# Altium schematic sheet Power Distribution - BMS,Rear Camera, and Charger.SchDoc: Title
size B; Organization: Midnight Sun Solar Rayce Car Team; Address1: University of Waterloo; Address2: 200 University Ave W; Address3: Waterloo, ON, Canada; Address4: N2L 3E9; Website: www.uwmidsun.com; ProjectName: ProjectName
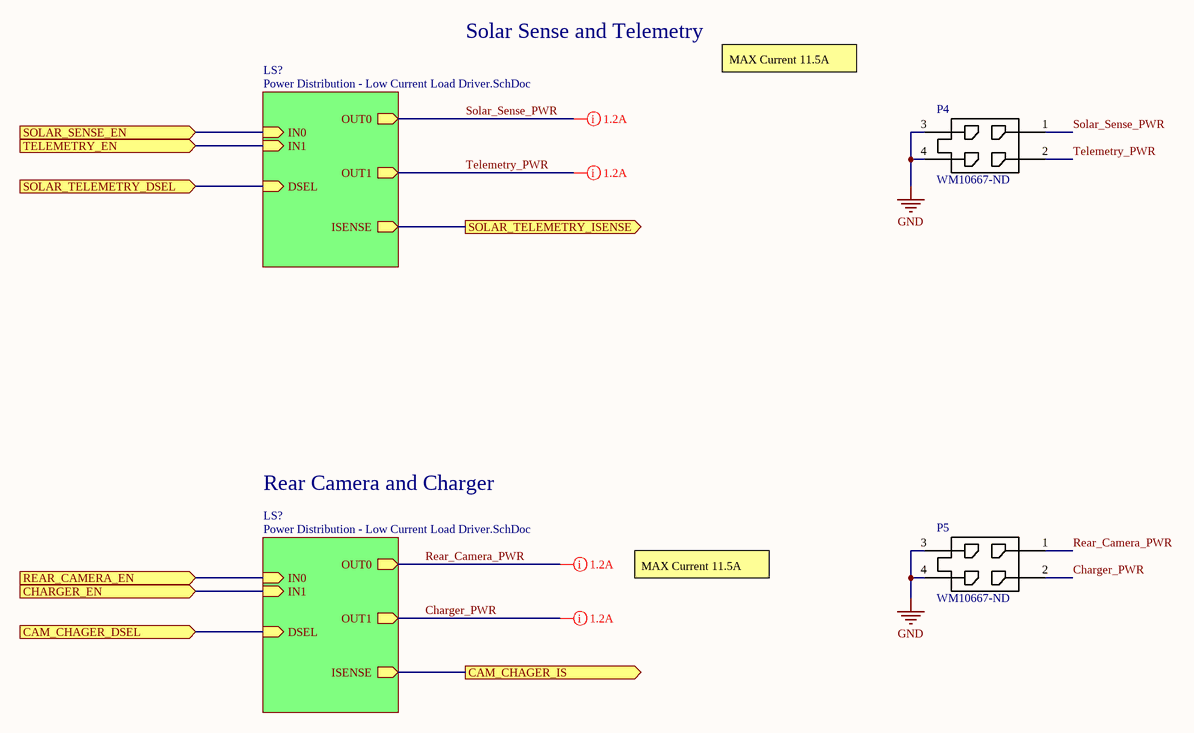
[diagram p0: Power Distribution - BMS,Rear Camera, and Charger.SchDoc]

## Parts
P4  Supplier Part Number 1: WM10667-ND  [CONN 4POS MICROFIT (2x2)]  (hidden comment: CONN 4POS MICRO-FIT 3mm)
P5  Supplier Part Number 1: WM10667-ND  [CONN 4POS MICROFIT (2x2)]  (hidden comment: CONN 4POS MICRO-FIT 3mm)

## Sub-sheets
LS? = Power Distribution - Low Current Load Driver.SchDoc: IN0 (in), IN1 (in), DSEL (in), ISENSE (out), OUT0 (out), OUT1 (out)
LS? = Power Distribution - Low Current Load Driver.SchDoc: IN0 (in), IN1 (in), DSEL (in), ISENSE (out), OUT0 (out), OUT1 (out)

## Ports
CAM_CHAGER_DSEL (in), CAM_CHAGER_IS (out), CHARGER_EN (in), REAR_CAMERA_EN (in), SOLAR_SENSE_EN (in), SOLAR_TELEMETRY_DSEL (in), SOLAR_TELEMETRY_ISENSE (out), TELEMETRY_EN (in)

## Nets
GND: P4.3 P4.4 P5.3 P5.4
CAM_CHAGER_DSEL: port CAM_CHAGER_DSEL, sheet LS?/DSEL
CAM_CHAGER_IS: port CAM_CHAGER_IS, sheet LS?/ISENSE
CHARGER_EN: port CHARGER_EN, sheet LS?/IN1
Charger_PWR: P5.2 ; sheet LS?/OUT1
REAR_CAMERA_EN: port REAR_CAMERA_EN, sheet LS?/IN0
Rear_Camera_PWR: P5.1 ; sheet LS?/OUT0
SOLAR_SENSE_EN: port SOLAR_SENSE_EN, sheet LS?/IN0
Solar_Sense_PWR: P4.1 ; sheet LS?/OUT0
SOLAR_TELEMETRY_DSEL: port SOLAR_TELEMETRY_DSEL, sheet LS?/DSEL
SOLAR_TELEMETRY_ISENSE: port SOLAR_TELEMETRY_ISENSE, sheet LS?/ISENSE
TELEMETRY_EN: port TELEMETRY_EN, sheet LS?/IN1
Telemetry_PWR: P4.2 ; sheet LS?/OUT1

## Layout directives
mark named 1.2A: Charger_PWR, Rear_Camera_PWR, Solar_Sense_PWR, Telemetry_PWR

## Notes on the sheet
- Solar Sense and Telemetry
- MAX Current 11.5A
- Rear Camera and Charger
- PROJECT
- DOCUMENT
- DRAWN BY
- LAST MODIFIED
- PART NUMBER
- REVISION
- SHEET
- VARIANT
- OF
- Engineering 5 - 1002
  University of Waterloo
  (519) 888-4567 x32978
  hardware@uwmidsun.com

## Library data of the parts
P4 P5 = CONN 4POS MICRO-FIT 3mm: Micro-Fit 3.0 Vertical Header, 3.00mm Pitch, Dual Row, 4 Circuits, with PCB Polarizing Peg, Tin, Glow-Wire Capable, Black; Manufacturer: Molex, LLC; Manufacturer Part Number: 430450427; Pitch - Mating: 0.118" (3.00mm); Number of Positions: 6; Number of Positions Loaded: All; Style: Board to Cable/Wire; Shrouding: Shrouded - 4 Wall; Contact Length - Post: 0.125" (3.18mm); Material Flammability Rating: UL94 V-0; Contact Resistance: 10mR; Number of Contacts: 4; Number of Ports: 1; Row Spacing: 0.118inch; RoHS: RoHS Compliant; Category: Connectors, Interconnects; Packaging: Tray; Part Status: Active; Connector Type: Header; Contact Type: Male Pin; Number of Rows: 2; Row Spacing - Mating: 0.118" (3.00mm); Mounting Type: Through Hole; Termination: Solder; Fastening Type: Locking Ramp; Contact Length - Mating: -; Overall Contact Length: -; Insulation Height: 0.390" (9.91mm); Contact Shape: Square; Contact Finish - Mating: Tin; Contact Finish Thickness - Mating: 60.0µin (1.52µm); Contact Finish - Post: Tin; Contact Material: Brass; Insulation Material: Liquid Crystal Polymer (LCP), Glass Filled; Features: Board Guide; Operating Temperature: -; Ingress Protection: -; Insulation Color: Black; Current Rating: -; Voltage Rating: -; Mated Stacking Heights: -; Contact Finish Thickness - Post: -; Applications: General Purpose, Medical, Military, Telecommunications; Mount: Through Hole; Contact Plating: Tin; Housing Material: Polymer; Color: Black; Number of Terminals: 4; Housing Color: Black; Min Operating Temperature: -40°C; Max Operating Temperature: 105°C; Package Quantity: 2232; Orientation: Straight; Length: 10.15mm; Pitch: 3mm; Depth: 8.77mm; ComponentLink4URL: http://www.molex.com/webdocs/datasheets/pdf/en-us/0430450427_PCB_HEADERS.pdf; ComponentLink4Description: http://www.molex.com/webdocs/datasheets/pdf/en-us/0430450427_PCB_HEADERS.pdf; Supplier 1: Digi-Key